# Altium project LPCB222__RLOOP__GIMBAL_INTERFACE.PrjPCB
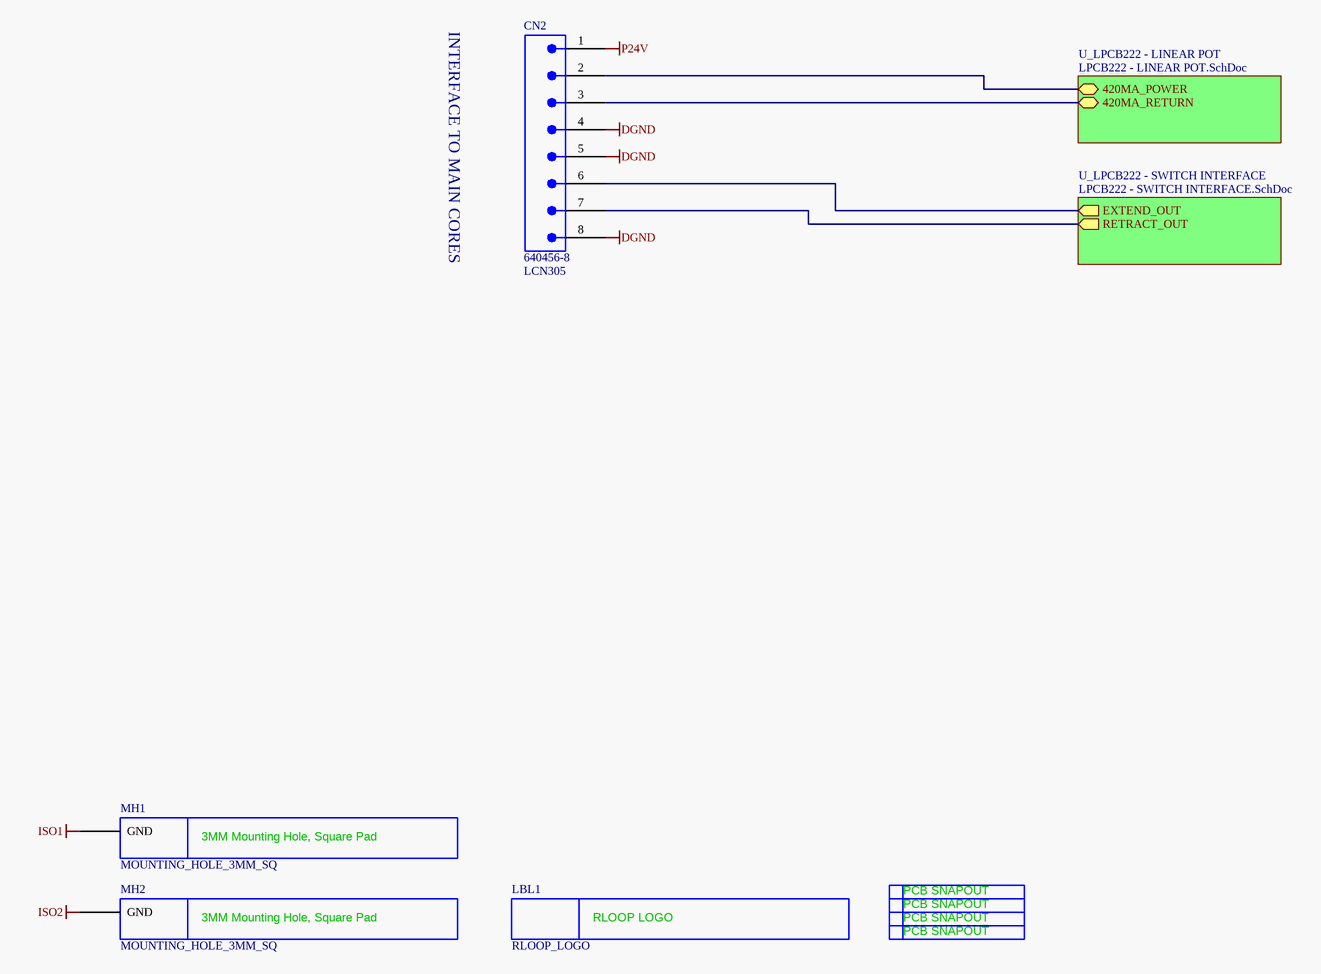
[diagram p0: LPCB222 - OVERVIEW.SchDoc]
3 sheets, 27 parts. Net scope: hierarchical (ports join the sheet entries above them; power ports are global).
Board files: LPCB222R0.PcbDoc, LPCB222R0__ASCII.PcbDoc
Sheets:
  LPCB222 - OVERVIEW.SchDoc
    U_LPCB222 - LINEAR POT = LPCB222 - LINEAR POT.SchDoc
    U_LPCB222 - SWITCH INTERFACE = LPCB222 - SWITCH INTERFACE.SchDoc

## Sheet LPCB222 - OVERVIEW.SchDoc
size A3; Address1: Factory 10; Address2: 9-13 Dingley Avenue, Dandeong, VICTORIA 3175, AUSTRALIA; DocumentNumber: 1; Revision: 1; SheetNumber: 1; SheetTotal: 3; Lockie__PCB_SUB_ASSEMBLY: Overview; Lockie__PCB_ASSEMBLY: Gimbal Interface; Lockie__LDL: LPCB222; Lockie__PCB_DESCRIPTION: Gimbal Interface

### Parts
CN2  640456-8  LDL_NUMBER: LCN305  [640456-8]
LBL1  RLOOP_LOGO  [RLOOP_LOGO]  (no BOM)
MH1  MOUNTING_HOLE_3MM_SQ  [MOUNTING_HOLE_3MM_SQ]  (no BOM)
MH2  MOUNTING_HOLE_3MM_SQ  [MOUNTING_HOLE_3MM_SQ]  (no BOM)
SN1  PCB_SNAPOUT  [SNAPOUT_NEW]  (value not drawn)  (no BOM)
SN2  PCB_SNAPOUT  [SNAPOUT_NEW]  (value not drawn)  (no BOM)
SN3  PCB_SNAPOUT  [SNAPOUT_NEW]  (value not drawn)  (no BOM)
SN4  PCB_SNAPOUT  [SNAPOUT_NEW]  (value not drawn)  (no BOM)

### Sub-sheets
U_LPCB222 - LINEAR POT = LPCB222 - LINEAR POT.SchDoc: 420MA_POWER (bidir), 420MA_RETURN (bidir)
U_LPCB222 - SWITCH INTERFACE = LPCB222 - SWITCH INTERFACE.SchDoc: EXTEND_OUT (out), RETRACT_OUT (out)

### Nets
DGND: CN2.4 CN2.5 CN2.8
ISO1: MH1.MOUNT(GND)
ISO2: MH2.MOUNT(GND)
P24V: CN2.1
EXTEND_OUT: CN2.6 ; sheet U_LPCB222 - SWITCH INTERFACE/EXTEND_OUT
RETRACT_OUT: CN2.7 ; sheet U_LPCB222 - SWITCH INTERFACE/RETRACT_OUT
NetC1_1: CN2.2 ; sheet U_LPCB222 - LINEAR POT/420MA_POWER
NetC1_2: CN2.3 ; sheet U_LPCB222 - LINEAR POT/420MA_RETURN

### Notes on the sheet
- INTERFACE TO MAIN CORES
- PCB COMPONENT DESCRIPTION
- LDL NUMBER
- Assembly Details
- Size
- Drawing File Name
- Revision
- http://rloop.org
- Scale
- A3
- Sheet Details
- N.T.S
- Sheet:
- Of:
- (in symbol MOUNTING_HOLE_3MM_SQ) 3MM Mounting Hole, Square Pad
- (in symbol PCB_SNAPOUT) PCB SNAPOUT
- (in symbol RLOOP_LOGO) RLOOP LOGO

### Library data of the parts
CN2 = 640456-8: Connector, Male Header, 8 Way; FMEDA__CHANNEL: COM; FMEDA__OPERATING__CURRENT_MAX: 0; FMEDA__OPERATING__TEMP_MAX: 50; FMEDA__OPERATING__TEMP_MIN: -20; FMEDA__OPERATING__TEMP_TYP: 27; FMEDA__OPERATING__VOLTAGE_MAX: 16; FMEDA__OPERATING__VOLTAGE_TYP: 12; FMEDA__FUNCTION_IN_SYSTEM: *; FMEDA__OPERATING__CURRENT_MIN: 0; FMEDA__OPERATING__CURRENT_TYP: 0; FMEDA__OPERATING__VOLTAGE_MIN: 0
LBL1 = RLOOP_LOGO: FMEDA__CHANNEL: DIAG; FMEDA__FUNCTION_IN_SYSTEM: *
MH1 MH2 = MOUNTING_HOLE_3MM_SQ: 3MM Mouting Hole, Square; FMEDA__CHANNEL: DIAG; FMEDA__FUNCTION_IN_SYSTEM: *
SN1-SN4 = PCB_SNAPOUT: FMEDA__CHANNEL: DIAG; FMEDA__FUNCTION_IN_SYSTEM: *

## Sheet LPCB222 - LINEAR POT.SchDoc
size A3; Address1: Factory 10; Address2: 9-13 Dingley Avenue, Dandeong, VICTORIA 3175, AUSTRALIA; DocumentNumber: 2; Revision: 1; SheetNumber: 2; SheetTotal: 3; Lockie__PCB_SUB_ASSEMBLY: Linear Pot; Lockie__PCB_ASSEMBLY: Gimbal Interface; Lockie__LDL: LPCB222; Lockie__PCB_DESCRIPTION: Gimbal Interface
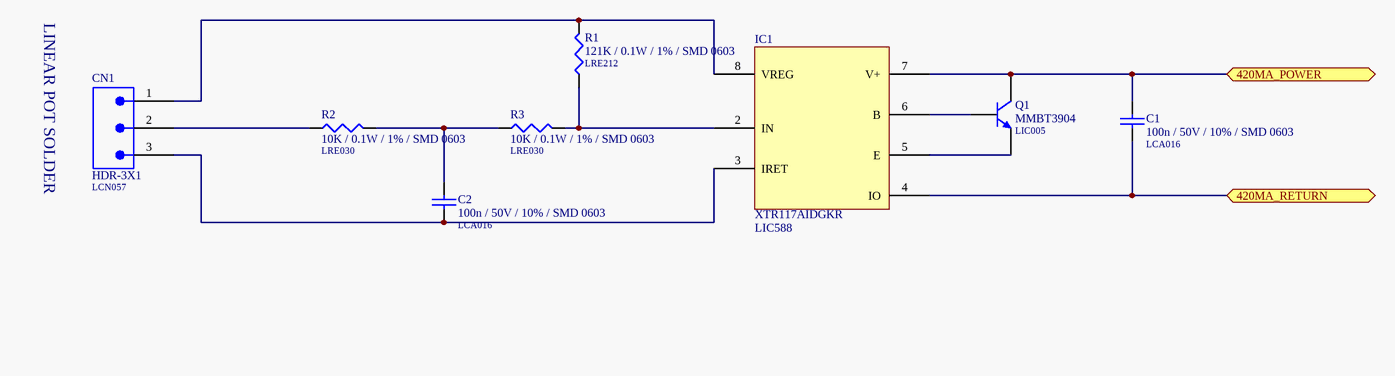
[diagram p1: LPCB222 - LINEAR POT.SchDoc]

### Parts
C1  100n / 50V / 10% / SMD 0603  LDL_NUMBER: LCA016  [LFP011__CC1608-0603-IPC7351_B]
C2  100n / 50V / 10% / SMD 0603  LDL_NUMBER: LCA016  [LFP011__CC1608-0603-IPC7351_B]
CN1  HDR-3X1  LDL_NUMBER: LCN057  [HDR-3X1]  (no BOM)
IC1  XTR117AIDGKR  LDL_NUMBER: LIC588  [LFP015__UMAX8]
Q1  MMBT3904  LDL_NUMBER: LIC005  [LFP021__SOT23]
R1  121K / 0.1W / 1% / SMD 0603  LDL_NUMBER: LRE212  [LFP020__CR1608-0603-IPC7351_B]
R2  10K / 0.1W / 1% / SMD 0603  LDL_NUMBER: LRE030  [LFP020__CR1608-0603-IPC7351_B]
R3  10K / 0.1W / 1% / SMD 0603  LDL_NUMBER: LRE030  [LFP020__CR1608-0603-IPC7351_B]

### Ports
420MA_POWER (bidir), 420MA_RETURN (bidir)

### Nets
NetC1_1: C1.1 IC1.7(V+) Q1.3(C) ; port 420MA_POWER
NetC1_2: C1.2 IC1.4(IO) ; port 420MA_RETURN
NetC2_1: C2.1 R2.2 R3.1
NetC2_2: C2.2 CN1.3 IC1.3(IRET)
NetCN1_1: CN1.1 IC1.8(VREG) R1.2
NetCN1_2: CN1.2 R2.1
NetIC1_2: IC1.2(IN) R1.1 R3.2
NetIC1_5: IC1.5(E) Q1.2(E)
NetIC1_6: IC1.6(B) Q1.1(B)

### Notes on the sheet
- LINEAR POT SOLDER
- PCB COMPONENT DESCRIPTION
- LDL NUMBER
- Assembly Details
- Size
- Drawing File Name
- Revision
- http://rloop.org
- Scale
- A3
- Sheet Details
- N.T.S
- Sheet:
- Of:

### Library data of the parts
C1 C2 = 100n / 50V / 10% / SMD 0603: Capacitor, Ceramic Chip, 100nF (0.1uF), 50V, 5%, SMD 0603 [LCA016]; FMEDA__OPERATING__VOLTAGE_MIN: 0; FMEDA__OPERATING__VOLTAGE_MAX: 3.3; FMEDA__OPERATING__TEMP_MIN: -20; FMEDA__OPERATING__TEMP_TYP: 27; FMEDA__OPERATING__TEMP_MAX: 50; FMEDA__CHANNEL: COM; Value: 100n; FMEDA__FUNCTION_IN_SYSTEM: *; FMEDA__OPERATING__VOLTAGE_TYP: 3.3
CN1 = HDR-3X1: Header, 2.54mm (0.1in), 3 Pins x 1 Row (40 Per Row In Strip); FMEDA__CHANNEL: COM; FMEDA__OPERATING__CURRENT_MAX: 0; FMEDA__OPERATING__TEMP_MAX: 50; FMEDA__OPERATING__TEMP_MIN: -20; FMEDA__OPERATING__TEMP_TYP: 27; FMEDA__OPERATING__VOLTAGE_MAX: 16; FMEDA__OPERATING__VOLTAGE_TYP: 12; FMEDA__FUNCTION_IN_SYSTEM: *; FMEDA__OPERATING__CURRENT_MIN: 0; FMEDA__OPERATING__CURRENT_TYP: 0; FMEDA__OPERATING__VOLTAGE_MIN: 0
IC1 = XTR117AIDGKR: IC, 4-20mA Current Loop Transmitter, SMD SOIC8 [LIC588]
Q1 = MMBT3904: Transistor, NPN, General Purpose, SOT-23 [LIC005]; FMEDA__OPERATING__POWER_MAX: 0; FMEDA__OPERATING__TEMP_MAX: 50; FMEDA__OPERATING__TEMP_MIN: -20; FMEDA__OPERATING__TEMP_TYP: 27; FMEDA__OPERATING__VOLTAGE_MAX: 3.3; FMEDA__CHANNEL: COM; FMEDA__OPERATING__POWER_MIN: 0; FMEDA__OPERATING__POWER_TYP: 0; FMEDA__OPERATING__VOLTAGE_MIN: 0; FMEDA__OPERATING__VOLTAGE_TYP: 3.3; FMEDA__FUNCTION_IN_SYSTEM: *
R1 = 121K / 0.1W / 1% / SMD 0603: Resistor, Ceramic Chip, 121K, 0.1W, SMD 0603 [LRE212]; FMEDA__OPERATING__POWER_MAX: 0; FMEDA__OPERATING__TEMP_MAX: 50; FMEDA__OPERATING__TEMP_MIN: -20; FMEDA__OPERATING__TEMP_TYP: 27; FMEDA__CHANNEL: COM; Value: 121K; FMEDA__OPERATING__POWER_MIN: 0; FMEDA__OPERATING__VOLTAGE_MAX: 0; FMEDA__OPERATING__VOLTAGE_MIN: 0; FMEDA__OPERATING__VOLTAGE_TYP: 0; FMEDA__FUNCTION_IN_SYSTEM: *
R2 R3 = 10K / 0.1W / 1% / SMD 0603: Resistor, Ceramic Chip, 10K, 0.1W, 1%, SMD 0603 [LRE030]; FMEDA__OPERATING__POWER_MAX: 0; FMEDA__OPERATING__TEMP_MAX: 50; FMEDA__OPERATING__TEMP_MIN: -20; FMEDA__OPERATING__TEMP_TYP: 27; FMEDA__CHANNEL: COM; Value: 10K; FMEDA__OPERATING__POWER_MIN: 0; FMEDA__OPERATING__VOLTAGE_MAX: 0; FMEDA__OPERATING__VOLTAGE_MIN: 0; FMEDA__OPERATING__VOLTAGE_TYP: 0; FMEDA__FUNCTION_IN_SYSTEM: *

## Sheet LPCB222 - SWITCH INTERFACE.SchDoc
size A3; Address1: Factory 10; Address2: 9-13 Dingley Avenue, Dandeong, VICTORIA 3175, AUSTRALIA; DocumentNumber: 3; Revision: 1; SheetNumber: 3; SheetTotal: 3; Lockie__PCB_SUB_ASSEMBLY: Switch Interface; Lockie__PCB_ASSEMBLY: Gimbal Interface; Lockie__LDL: LPCB222; Lockie__PCB_DESCRIPTION: Gimbal Interface
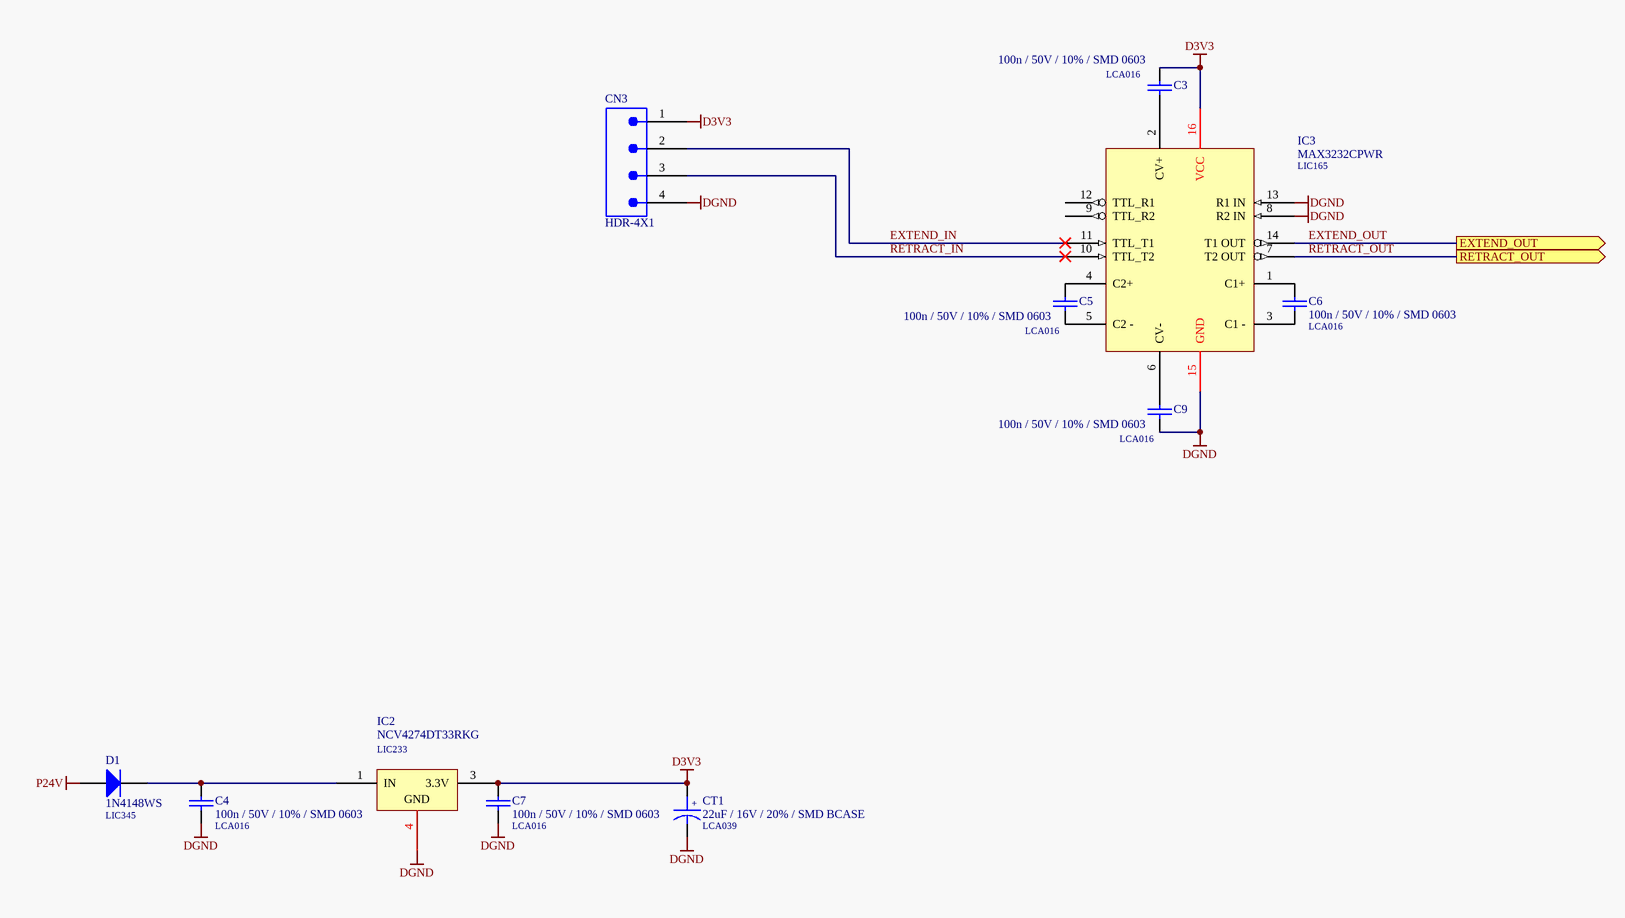
[diagram p2: LPCB222 - SWITCH INTERFACE.SchDoc]

### Parts
C3  100n / 50V / 10% / SMD 0603  LDL_NUMBER: LCA016  [LFP011__CC1608-0603-IPC7351_B]
C4  100n / 50V / 10% / SMD 0603  LDL_NUMBER: LCA016  [LFP011__CC1608-0603-IPC7351_B]
C5  100n / 50V / 10% / SMD 0603  LDL_NUMBER: LCA016  [LFP011__CC1608-0603-IPC7351_B]
C6  100n / 50V / 10% / SMD 0603  LDL_NUMBER: LCA016  [LFP011__CC1608-0603-IPC7351_B]
C7  100n / 50V / 10% / SMD 0603  LDL_NUMBER: LCA016  [LFP011__CC1608-0603-IPC7351_B]
C9  100n / 50V / 10% / SMD 0603  LDL_NUMBER: LCA016  [LFP011__CC1608-0603-IPC7351_B]
CN3  HDR-4X1  [HDR-4X1]  (no BOM)
CT1  22uF / 16V / 20% / SMD BCASE  LDL_NUMBER: LCA039  [LFP018__TC3528]
D1  1N4148WS  LDL_NUMBER: LIC345  [LFP001__SOD-323F]
IC2  NCV4274DT33RKG  LDL_NUMBER: LIC233  [LFP019__369A-13]
IC3  MAX3232CPWR  LDL_NUMBER: LIC165  [LFP049__TSSOP-16]

### Ports
EXTEND_OUT (out), RETRACT_OUT (out)

### Nets
D3V3: C3.1 C7.1 CN3.1 CT1.1 IC2.3(3.3V) IC3.16(VCC)
DGND: C4.2 C7.2 C9.2 CN3.4 CT1.2 IC2.4(GND) IC3.8(R2_IN) IC3.13(R1_IN) IC3.15(GND)
P24V: D1.2(A)
EXTEND_IN: CN3.2 IC3.11(TTL_T1)
EXTEND_OUT: IC3.14(T1_OUT) ; port EXTEND_OUT
RETRACT_IN: CN3.3 IC3.10(TTL_T2)
RETRACT_OUT: IC3.7(T2_OUT) ; port RETRACT_OUT
NetC3_2: C3.2 IC3.2(CV+)
NetC4_1: C4.1 D1.1(K) IC2.1(IN)
NetC5_1: C5.1 IC3.4(C2+)
NetC5_2: C5.2 IC3.5(C2_-)
NetC6_1: C6.1 IC3.1(C1+)
NetC6_2: C6.2 IC3.3(C1_-)
NetC9_1: C9.1 IC3.6(CV-)

Not connected (* = marked no-connect by the designer): IC3 9(TTL_R2) 12(TTL_R1)

### Notes on the sheet
- PCB COMPONENT DESCRIPTION
- LDL NUMBER
- Assembly Details
- Size
- Drawing File Name
- Revision
- http://rloop.org
- Scale
- A3
- Sheet Details
- N.T.S
- Sheet:
- Of:
- (in symbol 22uF / 16V / 20% / SMD BCASE) +

### Library data of the parts
C3 C5 C6 C9 = 100n / 50V / 10% / SMD 0603: as C1 on sheet LPCB222 - LINEAR POT; Value: 100n; FMEDA__FUNCTION_IN_SYSTEM: *; FMEDA__OPERATING__VOLTAGE_TYP: 3.3
C4 = 100n / 50V / 10% / SMD 0603: Capacitor, Ceramic Chip, 100nF, 50V, 10%, SMD 0603; FMEDA__OPERATING__VOLTAGE_MIN: 0; FMEDA__OPERATING__VOLTAGE_MAX: 24; FMEDA__FUNCTION_IN_SYSTEM: PSU B INPUT FILTER; FMEDA__OPERATING__VOLTAGE_TYP: 12; FMEDA__OPERATING__TEMP_MIN: -20; FMEDA__OPERATING__TEMP_TYP: 27; FMEDA__OPERATING__TEMP_MAX: 50; FMEDA__CHANNEL: CH1; Value: 100n
C7 = 100n / 50V / 10% / SMD 0603: Capacitor, Ceramic Chip, 100nF, 50V, 10%, SMD 0603; FMEDA__OPERATING__VOLTAGE_MIN: 0; FMEDA__OPERATING__VOLTAGE_MAX: 5; FMEDA__FUNCTION_IN_SYSTEM: PSU B OUT FILTER; FMEDA__OPERATING__TEMP_MIN: -20; FMEDA__OPERATING__TEMP_TYP: 27; FMEDA__OPERATING__TEMP_MAX: 50; FMEDA__CHANNEL: CH1; Value: 100n; FMEDA__OPERATING__VOLTAGE_TYP: 5
CN3 = HDR-4X1: Header, 2.54mm (0.1in), 4 Pins x 1 Row (40 Per Row In Strip); FMEDA__CHANNEL: COM; FMEDA__OPERATING__CURRENT_MAX: 0; FMEDA__OPERATING__TEMP_MAX: 50; FMEDA__OPERATING__TEMP_MIN: -20; FMEDA__OPERATING__TEMP_TYP: 27; FMEDA__OPERATING__VOLTAGE_MAX: 16; FMEDA__OPERATING__VOLTAGE_TYP: 12; FMEDA__FUNCTION_IN_SYSTEM: *; FMEDA__OPERATING__CURRENT_MIN: 0; FMEDA__OPERATING__CURRENT_TYP: 0; FMEDA__OPERATING__VOLTAGE_MIN: 0
CT1 = 22uF / 16V / 20% / SMD BCASE: Capacitor, Tantalum, 22uF, 16V, 20%, SMD B-Case; Value: 22u; FMEDA__OPERATING__VOLTAGE_MAX: 5; FMEDA__OPERATING__VOLTAGE_MIN: 0; FMEDA__OPERATING__TEMP_MAX: 50; FMEDA__OPERATING__TEMP_MIN: -20; FMEDA__OPERATING__TEMP_TYP: 27; FMEDA__FUNCTION_IN_SYSTEM: PSU B OUT FILTER; FMEDA__CHANNEL: CH1; FMEDA__OPERATING__VOLTAGE_TYP: 5
D1 = 1N4148WS: Diode, Small Signal, SMD SOD-323F; FMEDA__FUNCTION_IN_SYSTEM: PSU B INPUT DIODE; FMEDA__OPERATING__TEMP_MAX: 50; FMEDA__OPERATING__TEMP_MIN: -20; FMEDA__OPERATING__TEMP_TYP: 27; FMEDA__OPERATING__VOLTAGE_MAX: 24; FMEDA__OPERATING__VOLTAGE_MIN: 0; FMEDA__OPERATING__VOLTAGE_TYP: 12; FMEDA__CHANNEL: CH1; FMEDA__OPERATING__CURRENT_MAX: 0; FMEDA__OPERATING__CURRENT_MIN: 0; FMEDA__OPERATING__CURRENT_TYP: 0
IC2 = NCV4274DT33RKG: IC, Voltage Regulator, 400mA, 3.3V LDO, SMD DPAK [LIC233]; FMEDA__OPERATING__OUTPUT_CURRENT_MIN: 0; FMEDA__OPERATING__TEMP_MAX: 50; FMEDA__OPERATING__TEMP_MIN: -20; FMEDA__OPERATING__TEMP_TYP: 27; VALUE: 0; Note: Obey Thermal Design Rules; FMEDA__CHANNEL: COM; FMEDA__OPERATING__OUTPUT_CURRENT_TYP: 0; FMEDA__OPERATING__VOLTAGE_MAX: 0; FMEDA__OPERATING__VOLTAGE_MIN: 0; FMEDA__OPERATING__VOLTAGE_TYP: 0; FMEDA__FUNCTION_IN_SYSTEM: *
IC3 = MAX3232CPWR: IC, RS232 Line Driver, 3.3V, SMD TSSOP16 [LIC165]; FMEDA__OPERATING__TEMP_MAX: 50; FMEDA__OPERATING__TEMP_MIN: -20; FMEDA__OPERATING__TEMP_TYP: 27; FMEDA__CHANNEL: COM; FMEDA__OPERATING__VOLTAGE_MAX: 3.3; FMEDA__OPERATING__VOLTAGE_MIN: 0; FMEDA__FUNCTION_IN_SYSTEM: *; FMEDA__OPERATING__VOLTAGE_TYP: 3.3

## Nets that join several sheets
DGND: LPCB222 - OVERVIEW (CN2.4 CN2.5 CN2.8), LPCB222 - SWITCH INTERFACE (9 pins)
P24V: LPCB222 - OVERVIEW (CN2.1), LPCB222 - SWITCH INTERFACE (D1.2)
EXTEND_OUT: LPCB222 - OVERVIEW (CN2.6), LPCB222 - SWITCH INTERFACE (IC3.14)
NetC1_1: LPCB222 - OVERVIEW (CN2.2), LPCB222 - LINEAR POT (C1.1 IC1.7 Q1.3)
NetC1_2: LPCB222 - OVERVIEW (CN2.3), LPCB222 - LINEAR POT (C1.2 IC1.4)
RETRACT_OUT: LPCB222 - OVERVIEW (CN2.7), LPCB222 - SWITCH INTERFACE (IC3.7)